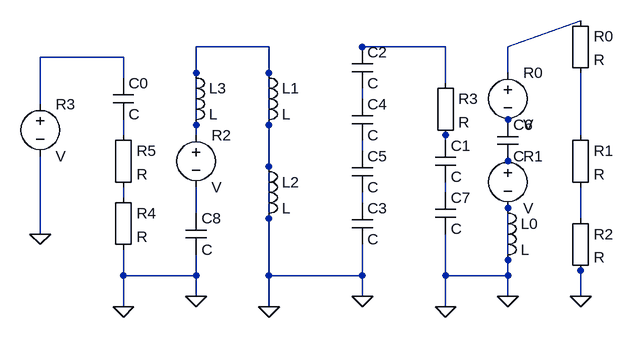
[diagram p0: schematic out.asc]
out.asc, the LTspice schematic file:
Version 4
SHEET 1 1000 1000
SYMBOL ind 784 280 R0
SYMATTR InstName L0
WIRE 800 296 800 400
WIRE 800 376 800 296
SYMBOL Misc\EuropeanResistor 896 -8 R0
SYMATTR InstName R0
WIRE 912 8 800 48
WIRE 912 88 912 136
SYMBOL Misc\EuropeanResistor 896 168 R0
SYMATTR InstName R1
WIRE 912 184 912 136
WIRE 912 264 912 288
SYMBOL Misc\EuropeanResistor 896 296 R0
SYMATTR InstName R2
WIRE 912 312 912 288
WIRE 912 392 912 392
SYMBOL Misc\EuropeanResistor 688 88 R0
SYMATTR InstName R3
WIRE 704 104 704 48
WIRE 704 184 704 184
SYMBOL ind 416 72 R0
SYMATTR InstName L1
WIRE 432 88 432 200
WIRE 432 168 432 48
SYMBOL ind 416 216 R0
SYMATTR InstName L2
WIRE 432 232 432 400
WIRE 432 312 432 200
SYMBOL ind 304 72 R0
SYMATTR InstName L3
WIRE 320 88 320 176
WIRE 320 168 320 48
SYMBOL Misc\EuropeanResistor 192 264 R0
SYMATTR InstName R4
WIRE 208 280 208 272
WIRE 208 360 208 400
SYMBOL Misc\EuropeanResistor 192 168 R0
SYMATTR InstName R5
WIRE 208 184 208 176
WIRE 208 264 208 272
SYMBOL cap 192 96 R0
SYMATTR InstName C0
WIRE 208 96 208 64
WIRE 208 160 208 176
SYMBOL cap 688 192 R0
SYMATTR InstName C1
WIRE 704 192 704 184
WIRE 704 256 704 264
SYMBOL cap 560 48 R0
SYMATTR InstName C2
WIRE 576 48 576 48
WIRE 576 112 576 120
SYMBOL cap 560 288 R0
SYMATTR InstName C3
WIRE 576 288 576 280
WIRE 576 352 576 400
SYMBOL cap 560 128 R0
SYMATTR InstName C4
WIRE 576 128 576 120
WIRE 576 192 576 200
SYMBOL cap 560 208 R0
SYMATTR InstName C5
WIRE 576 208 576 200
WIRE 576 272 576 280
FLAG 704 448 0
WIRE 704 448 704 400
FLAG 800 432 0
WIRE 800 432 800 400
FLAG 912 432 0
WIRE 912 432 912 392
FLAG 576 432 0
WIRE 576 432 576 400
FLAG 432 448 0
WIRE 432 448 432 400
FLAG 80 336 0
WIRE 80 336 80 256
FLAG 208 448 0
WIRE 208 448 208 400
FLAG 320 432 0
WIRE 320 432 320 400
SYMBOL voltage 800 72 R0
SYMATTR InstName R0
WIRE 800 88 800 48
WIRE 800 168 800 160
SYMBOL cap 784 160 R0
SYMATTR InstName C6
WIRE 800 160 800 160
WIRE 800 224 800 224
SYMBOL voltage 800 200 R0
SYMATTR InstName R1
WIRE 800 216 800 224
WIRE 800 296 800 296
SYMBOL cap 688 272 R0
SYMATTR InstName C7
WIRE 704 272 704 264
WIRE 704 336 704 400
SYMBOL voltage 320 168 R0
SYMATTR InstName R2
WIRE 320 184 320 176
WIRE 320 264 320 280
SYMBOL cap 304 304 R0
SYMATTR InstName C8
WIRE 320 304 320 280
WIRE 320 368 320 400
SYMBOL voltage 80 120 R0
SYMATTR InstName R3
WIRE 80 136 80 64
WIRE 80 216 80 256
WIRE 800 400 704 400
WIRE 704 48 576 48
WIRE 432 400 576 400
WIRE 320 400 208 400
WIRE 208 64 80 64
WIRE 432 48 320 48

The netlist it stands for:
* out.asc
L0 0 0 L
R0 N001 N002 R
R1 N002 N003 R
R2 N003 0 R
R3 N004 N005 R
L1 0 0 L
L2 0 0 L
L3 0 0 L
R4 N006 0 R
R5 N007 N006 R
C0 N008 N007 C
C1 N005 N009 C
C2 N004 N010 C
C3 N011 0 C
C4 N010 N012 C
C5 N012 N011 C
V§R0 N001 N013 V
C6 N013 N014 C
V§R1 N014 0 V
C7 N009 0 C
V§R2 0 N015 V
C8 N015 0 C
V§R3 N008 0 V
.backanno
.end